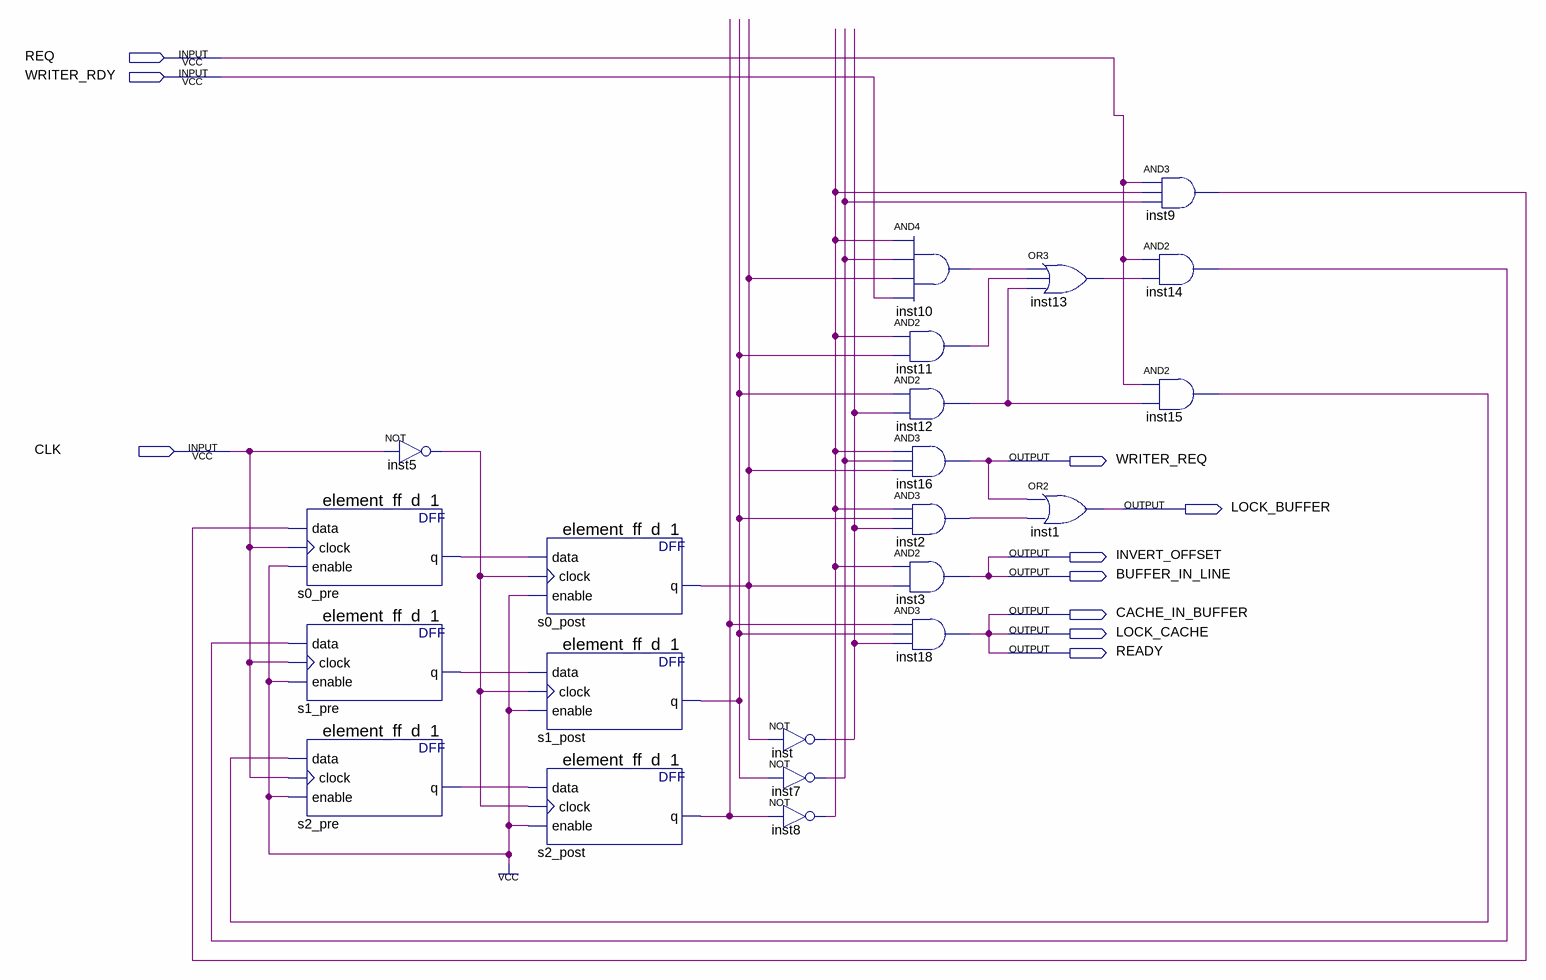
[diagram p0: schematic sheet]
// Quartus schematic block-data-cache-state-machine-wh.bdf as structural Verilog: 22 symbols, 10 pins
module \block-data-cache-state-machine-wh  (
  input  REQ,
  input  WRITER_RDY,
  input  CLK,
  output WRITER_REQ,
  output LOCK_BUFFER,
  output INVERT_OFFSET,
  output BUFFER_IN_LINE,
  output CACHE_IN_BUFFER,
  output LOCK_CACHE,
  output READY
);

  wire inst2_out, inst5_out, inst7_out, inst8_out, inst9_out, inst10_out, inst11_out, inst12_out, inst13_out,
       inst14_out, inst15_out, inst_out, s0_post_q, s0_pre_q, s1_post_q, s1_pre_q, s2_post_q, s2_pre_q;

  element_ff_d_1 s0_pre (.data(inst9_out), .clock(CLK), .enable(1'b1), .q(s0_pre_q));
  element_ff_d_1 s1_pre (.data(inst14_out), .clock(CLK), .enable(1'b1), .q(s1_pre_q));
  element_ff_d_1 s2_pre (.data(inst15_out), .clock(CLK), .enable(1'b1), .q(s2_pre_q));
  not inst5 (inst5_out, CLK);
  element_ff_d_1 s0_post (.data(s0_pre_q), .clock(inst5_out), .enable(1'b1), .q(s0_post_q));
  element_ff_d_1 s1_post (.data(s1_pre_q), .clock(inst5_out), .enable(1'b1), .q(s1_post_q));
  element_ff_d_1 s2_post (.data(s2_pre_q), .clock(inst5_out), .enable(1'b1), .q(s2_post_q));
  not inst (inst_out, s0_post_q);
  not inst7 (inst7_out, s1_post_q);
  not inst8 (inst8_out, s2_post_q);
  and inst10 (inst10_out, inst8_out, inst7_out, s0_post_q, WRITER_RDY);
  and inst11 (inst11_out, inst8_out, s1_post_q);
  and inst12 (inst12_out, s1_post_q, inst_out);
  and inst16 (WRITER_REQ, inst8_out, inst7_out, s0_post_q);
  and inst2 (inst2_out, inst8_out, s1_post_q, inst_out);
  and inst3 (BUFFER_IN_LINE, inst8_out, s0_post_q);
  and inst18 (CACHE_IN_BUFFER, s2_post_q, s1_post_q, inst_out);
  or inst13 (inst13_out, inst10_out, inst11_out, inst12_out);
  or inst1 (LOCK_BUFFER, WRITER_REQ, inst2_out);
  and inst9 (inst9_out, REQ, inst8_out, inst7_out);
  and inst14 (inst14_out, REQ, inst13_out);
  and inst15 (inst15_out, REQ, inst12_out);

  assign INVERT_OFFSET = BUFFER_IN_LINE;
  assign LOCK_CACHE = CACHE_IN_BUFFER;
  assign READY = CACHE_IN_BUFFER;
endmodule
